# EAGLE schematic box' (EAGLE 6.4)
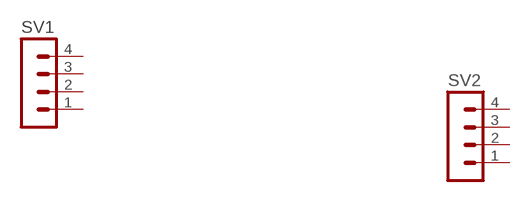
[diagram p0: schematic, sheet 1]

## Parts
SV1  MA04-1  [MA04-1]
SV2  MA04-1  [MA04-1]
Unconnected: SV1.1 SV1.2 SV1.3 SV1.4 SV2.1 SV2.2 SV2.3 SV2.4

## Library data of the parts
SV1 SV2 = con-lstb:MA04-1: PIN HEADER; OC_FARNELL: unknown; OC_NEWARK: unknown